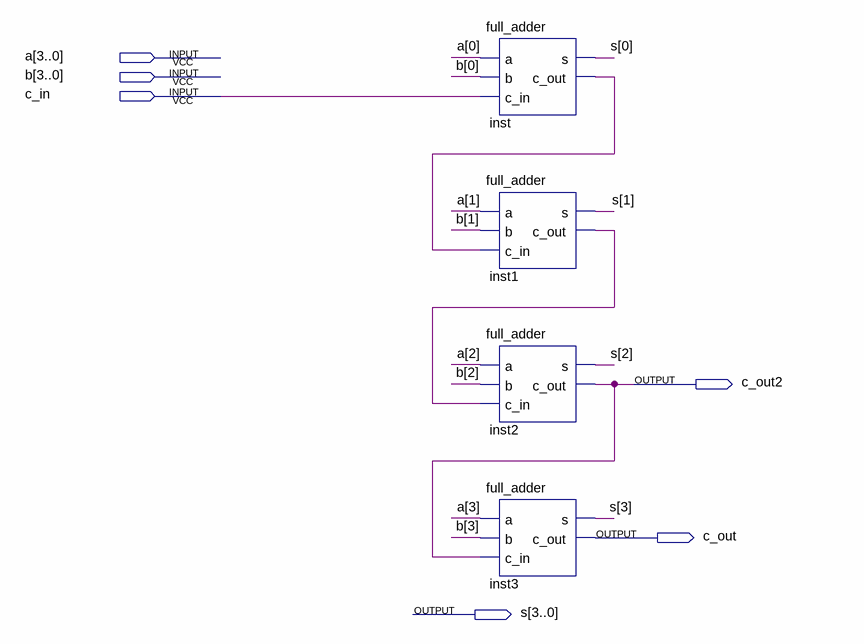
[diagram p0: schematic sheet]
// Quartus schematic somador4bits.bdf as structural Verilog: 4 symbols, 6 pins
module somador4bits (
  input  [3:0] a,
  input  [3:0] b,
  input  c_in,
  output c_out2,
  output c_out,
  output [3:0] s
);

  wire inst1_c_out, inst_c_out;

  full_adder inst (.a(a[0]), .b(b[0]), .c_in(c_in), .s(s[0]), .c_out(inst_c_out));
  full_adder inst1 (.a(a[1]), .b(b[1]), .c_in(inst_c_out), .s(s[1]), .c_out(inst1_c_out));
  full_adder inst2 (.a(a[2]), .b(b[2]), .c_in(inst1_c_out), .s(s[2]), .c_out(c_out2));
  full_adder inst3 (.a(a[3]), .b(b[3]), .c_in(c_out2), .s(s[3]), .c_out(c_out));
endmodule
